# Altium schematic sheet 01_index.SchDoc
size 297 x 209 mm
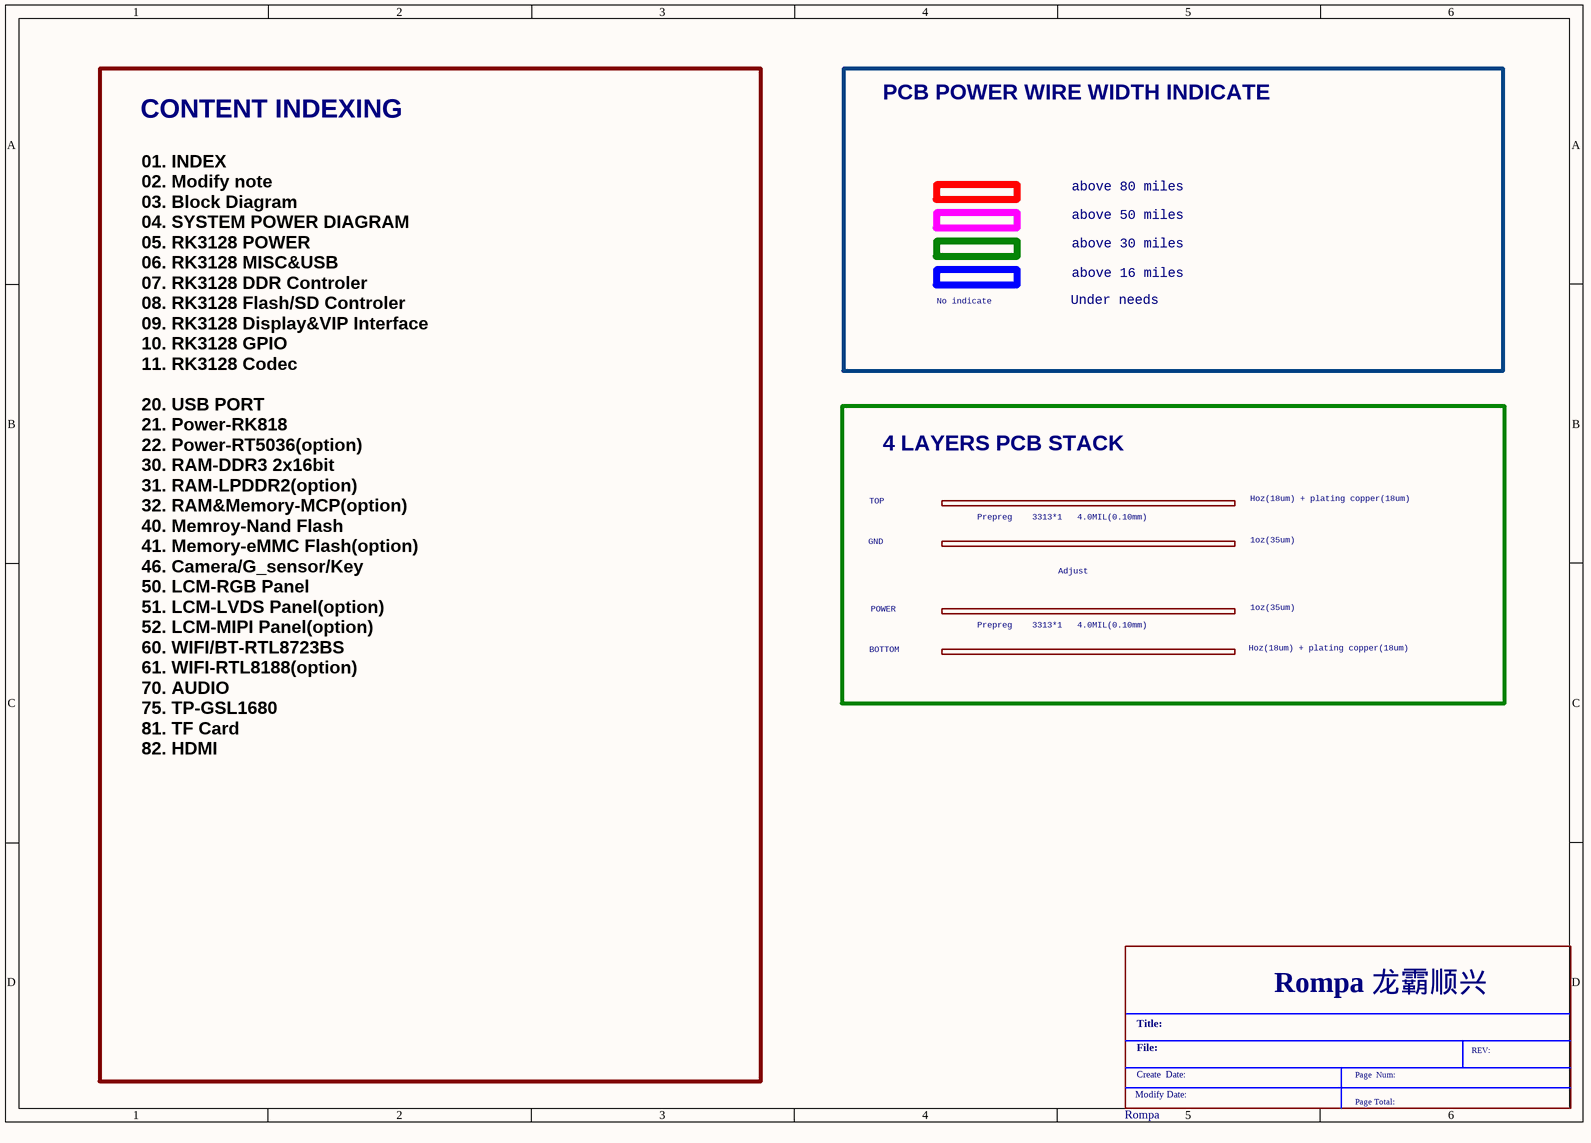
[diagram p0: 01_index.SchDoc]

## Parts
*  Rompa  (graphical)

## Notes on the sheet
- CONTENT INDEXING
- PCB POWER WIRE WIDTH INDICATE
- above 80 miles
- above 50 miles
- above 30 miles
- No indicate
- Under needs
- above 16 miles
- 4 LAYERS PCB STACK
- TOP
- Prepreg    3313*1   4.0MIL(0.10mm)
- Hoz(18um) + plating copper(18um)
- 1oz(35um)
- GND
- POWER
- Adjust
- BOTTOM
- 01. INDEX
  02. Modify note
  03. Block Diagram
  04. SYSTEM POWER DIAGRAM
  05. RK3128 POWER
  06. RK3128 MISC&USB
  07. RK3128 DDR Controler
  08. RK3128 Flash/SD Controler
  09. RK3128 Display&VIP Interface
  10. RK3128 GPIO
  11. RK3128 Codec
  20. USB PORT
  21. Power-RK818
  22. Power-RT5036(option)
  30. RAM-DDR3 2x16bit
  31. RAM-LPDDR2(option)
  32. RAM&Memory-MCP(option)
  40. Memroy-Nand Flash
  41. Memory-eMMC Flash(option)
  46. Camera/G_sensor/Key
  50. LCM-RGB Panel
  51. LCM-LVDS Panel(option)
  52. LCM-MIPI Panel(option)
  60. WIFI/BT-RTL8723BS
  61. WIFI-RTL8188(option)
  70. AUDIO
  75. TP-GSL1680
  81. TF Card
  82. HDMI
- (in symbol Rompa) Rompa 龙霸顺兴; Title:; File:; REV:; Create  Date:; Page  Num:; Modify Date:; Page Total: